# EAGLE design SatNOGSBoard (EAGLE 7.2.0)
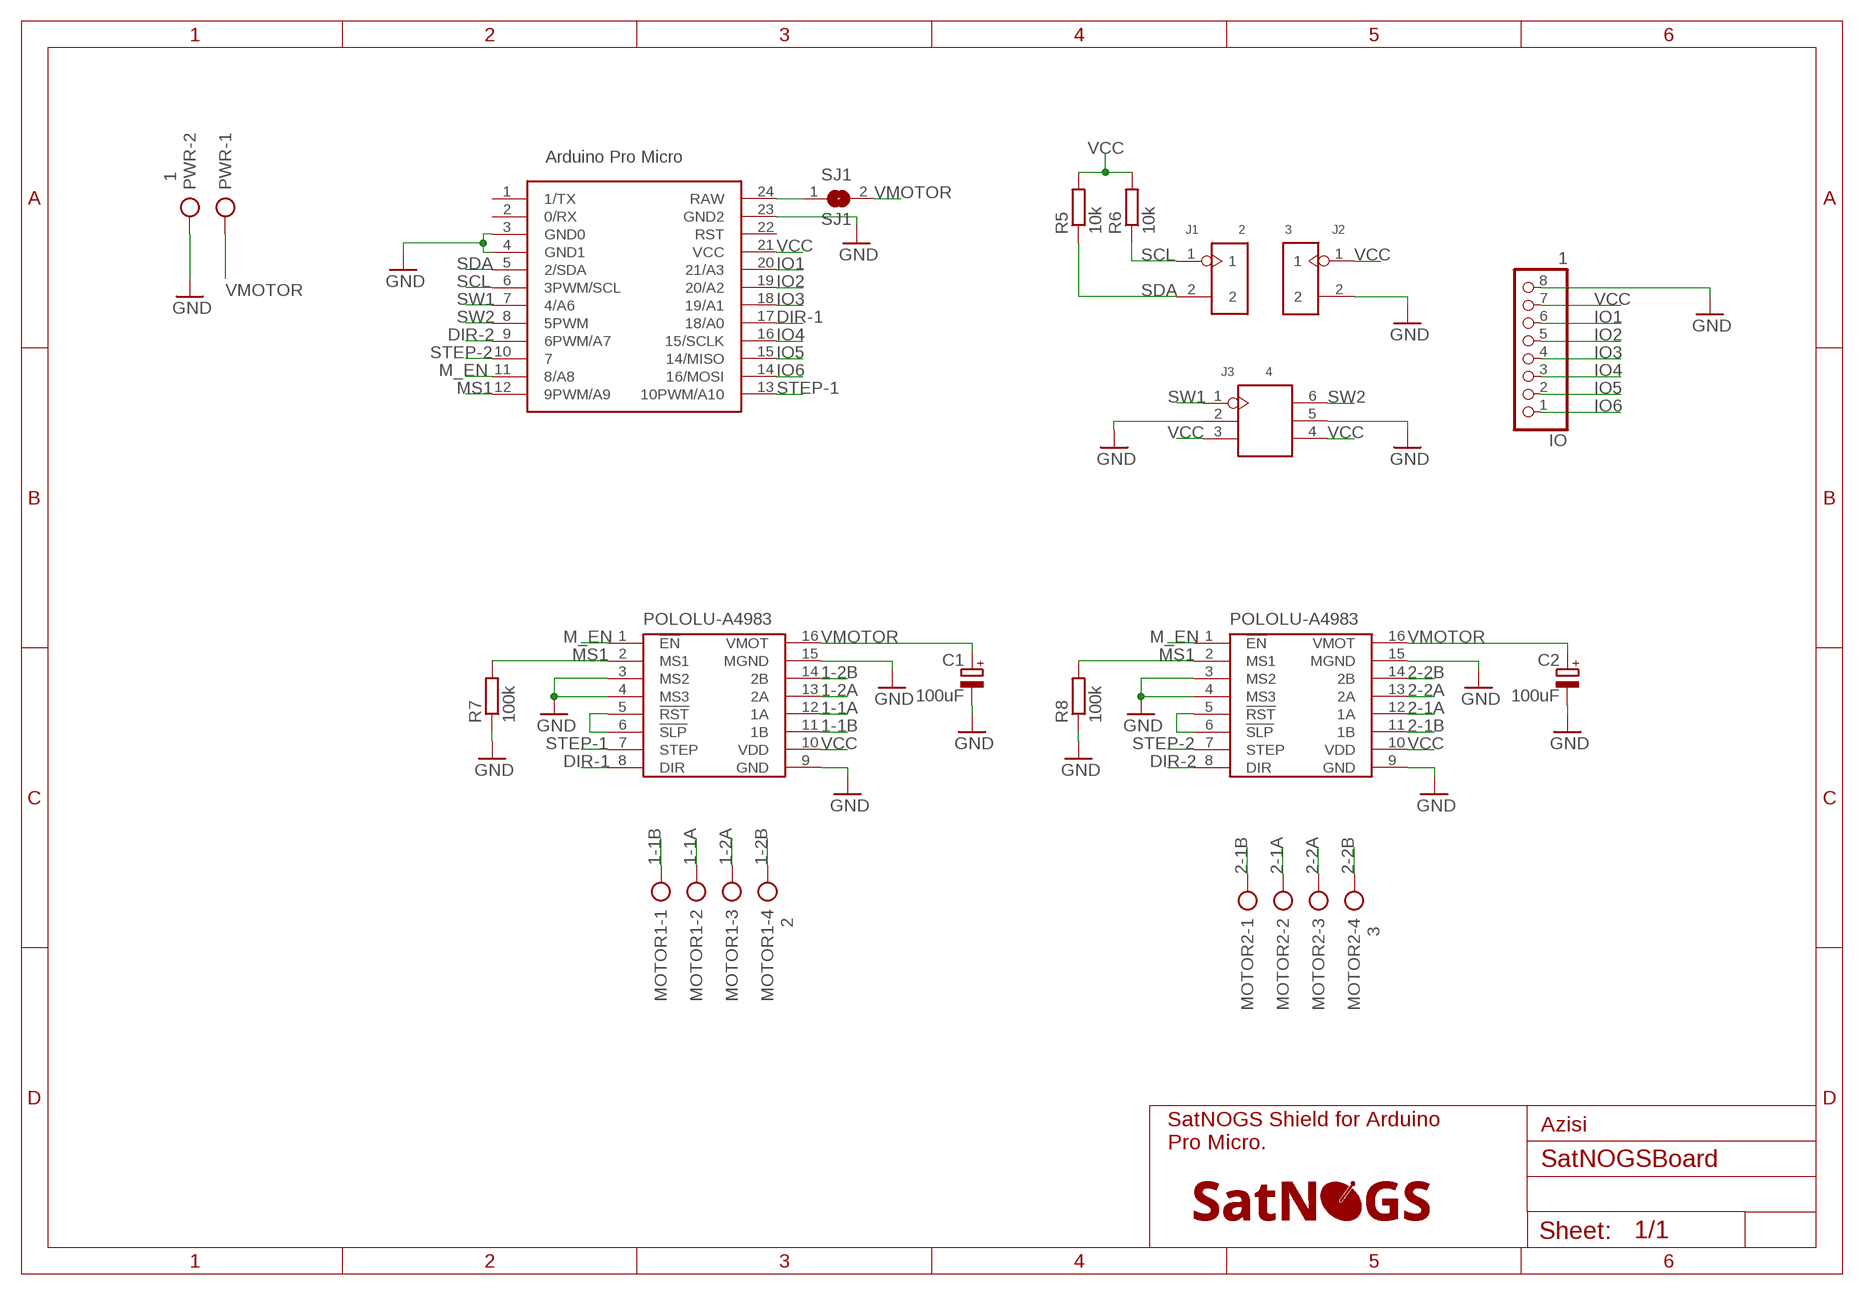
[diagram p0: schematic, sheet 1]

## Parts
AZIMUTH  POLOLU-A4983POLOLU-A4983  [POLOLU-A4983]
C1  100uF  CPOL-EUE2.5-6  [E2,5-6]
C2  100uF  CPOL-EUE2.5-6  [E2,5-6]
ELEVATION  POLOLU-A4983POLOLU-A4983  [POLOLU-A4983]
IO  1  PINHD-1X8  [1X08]
J1  2  HEADER-2P-65/35MIL  [2P-2.54-65/35MIL]
J2  3  HEADER-2P-65/35MIL  [2P-2.54-65/35MIL]
J3  4  HEADER-2X3P-2.54  [2X3P-2.54-65/35MIL]
MOTOR1  2  AK500/4  [AK500/4]
MOTOR2  3  AK500/4  [AK500/4]
PWR  1  AK500/2  [AK500/2]
R5  10k  R-EU_R0805  [R0805]
R6  10k  R-EU_R0805  [R0805]
R7  100k  R-EU_R0805  [R0805]
R8  100k  R-EU_R0805  [R0805]
SJ1  SJ1  SJW  [SJW]
U$1  SATNOGS_LOGORESTRICT_M  [LOGO_RESTRICT_M]
UC  ARDUINO_PRO_MICROARDUINO_BOARD  [ARDUINO_MICRO_PRO]

## Nets
1-1A: AZIMUTH.12(1A) MOTOR1.2
1-1B: AZIMUTH.11(1B) MOTOR1.1
1-2A: AZIMUTH.13(2A) MOTOR1.3
1-2B: AZIMUTH.14(2B) MOTOR1.4
2-1A: ELEVATION.12(1A) MOTOR2.2
2-1B: ELEVATION.11(1B) MOTOR2.1
2-2A: ELEVATION.13(2A) MOTOR2.3
2-2B: ELEVATION.14(2B) MOTOR2.4
DIR-1: AZIMUTH.8(DIR) UC.17(18/A0)
DIR-2: ELEVATION.8(DIR) UC.9(6PWM/A7)
GND: AZIMUTH.3(MS2) AZIMUTH.4(MS3) AZIMUTH.9(GND) AZIMUTH.15(MGND) C1.- C2.- ELEVATION.3(MS2) ELEVATION.4(MS3) ELEVATION.9(GND) ELEVATION.15(MGND) IO.8 J2.2 J3.2 J3.5 PWR.2 R7.1 R8.1 UC.3(GND0) UC.4(GND1) UC.23(GND2)
IO1: IO.6 UC.20(21/A3)
IO2: IO.5 UC.19(20/A2)
IO3: IO.4 UC.18(19/A1)
IO4: IO.3 UC.16(15/SCLK)
IO5: IO.2 UC.15(14/MISO)
IO6: IO.1 UC.14(16/MOSI)
M_EN: AZIMUTH.1(!EN) ELEVATION.1(!EN) UC.11(8/A8)
MS1: AZIMUTH.2(MS1) ELEVATION.2(MS1) R7.2 R8.2 UC.12(9PWM/A9)
N$1: AZIMUTH.5(!RST) AZIMUTH.6(!SLP)
N$2: ELEVATION.5(!RST) ELEVATION.6(!SLP)
N$3: SJ1.1 UC.24(RAW)
SCL: J1.1 R6.1 UC.6(3PWM/SCL)
SDA: J1.2 R5.1 UC.5(2/SDA)
STEP-1: AZIMUTH.7(STEP) UC.13(10PWM/A10)
STEP-2: ELEVATION.7(STEP) UC.10
SW1: J3.1 UC.7(4/A6)
SW2: J3.6 UC.8(5PWM)
VCC: AZIMUTH.10(VDD) ELEVATION.10(VDD) IO.7 J2.1 J3.3 J3.4 R5.2 R6.2 UC.21(VCC)
VMOTOR: AZIMUTH.16(VMOT) C1.+ C2.+ ELEVATION.16(VMOT) PWR.1 SJ1.2
Unconnected: UC.1(1/TX) UC.2(0/RX) UC.22(RST)

## Notes on the sheet
- Azisi
- SatNOGS Shield for Arduino
  Pro Micro.

## Library data of the parts
AZIMUTH ELEVATION = satnogs:POLOLU-A4983
C1 C2 = rcl:CPOL-EU: POLARIZED CAPACITOR, European symbol
IO = pinhead:PINHD-1X8: PIN HEADER
J1 J2 = Connector:HEADER-2P
J3 = Connector:HEADER-2X3P
MOTOR1 MOTOR2 = con-ptr500:AK500/4: CONNECTOR; OC_FARNELL: unknown; OC_NEWARK: unknown
PWR = con-ptr500:AK500/2: CONNECTOR; OC_FARNELL: unknown; OC_NEWARK: unknown
R5-R8 = rcl:R-EU_: RESISTOR, European symbol
SJ1 = jumper:SJ: SMD solder JUMPER
U$1 = satnogs:SATNOGS_LOGO
UC = Arduino_Pro_Micro:ARDUINO_PRO_MICRO

## Board
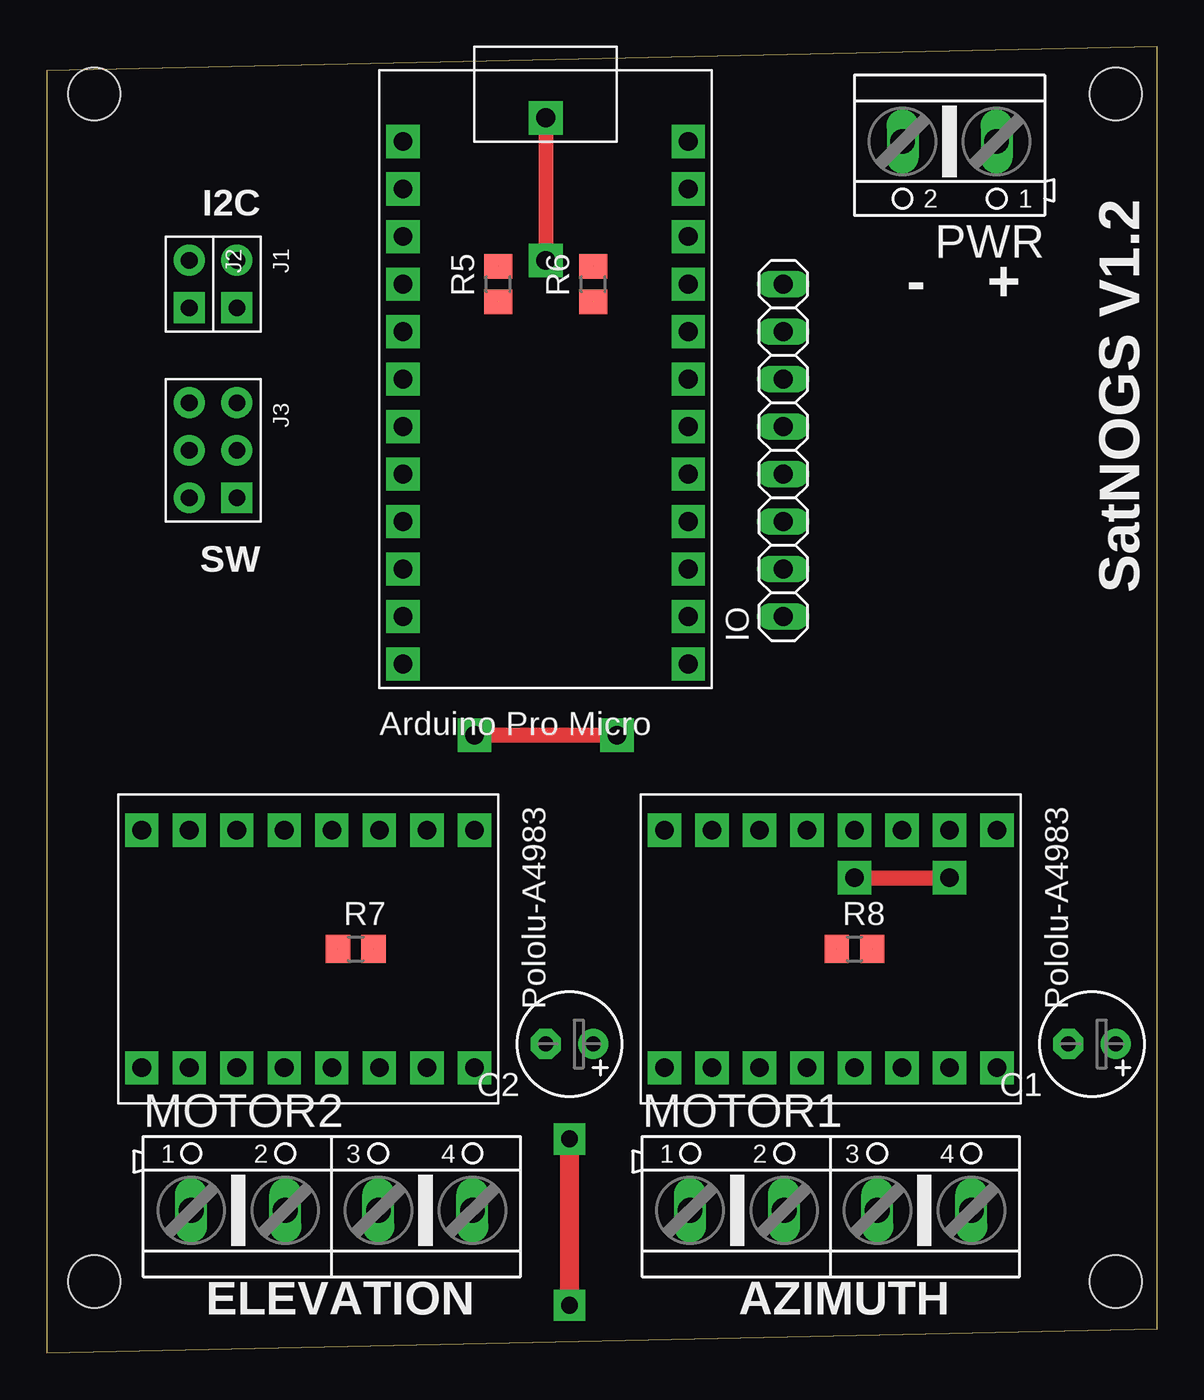
[diagram p1: board, top side]
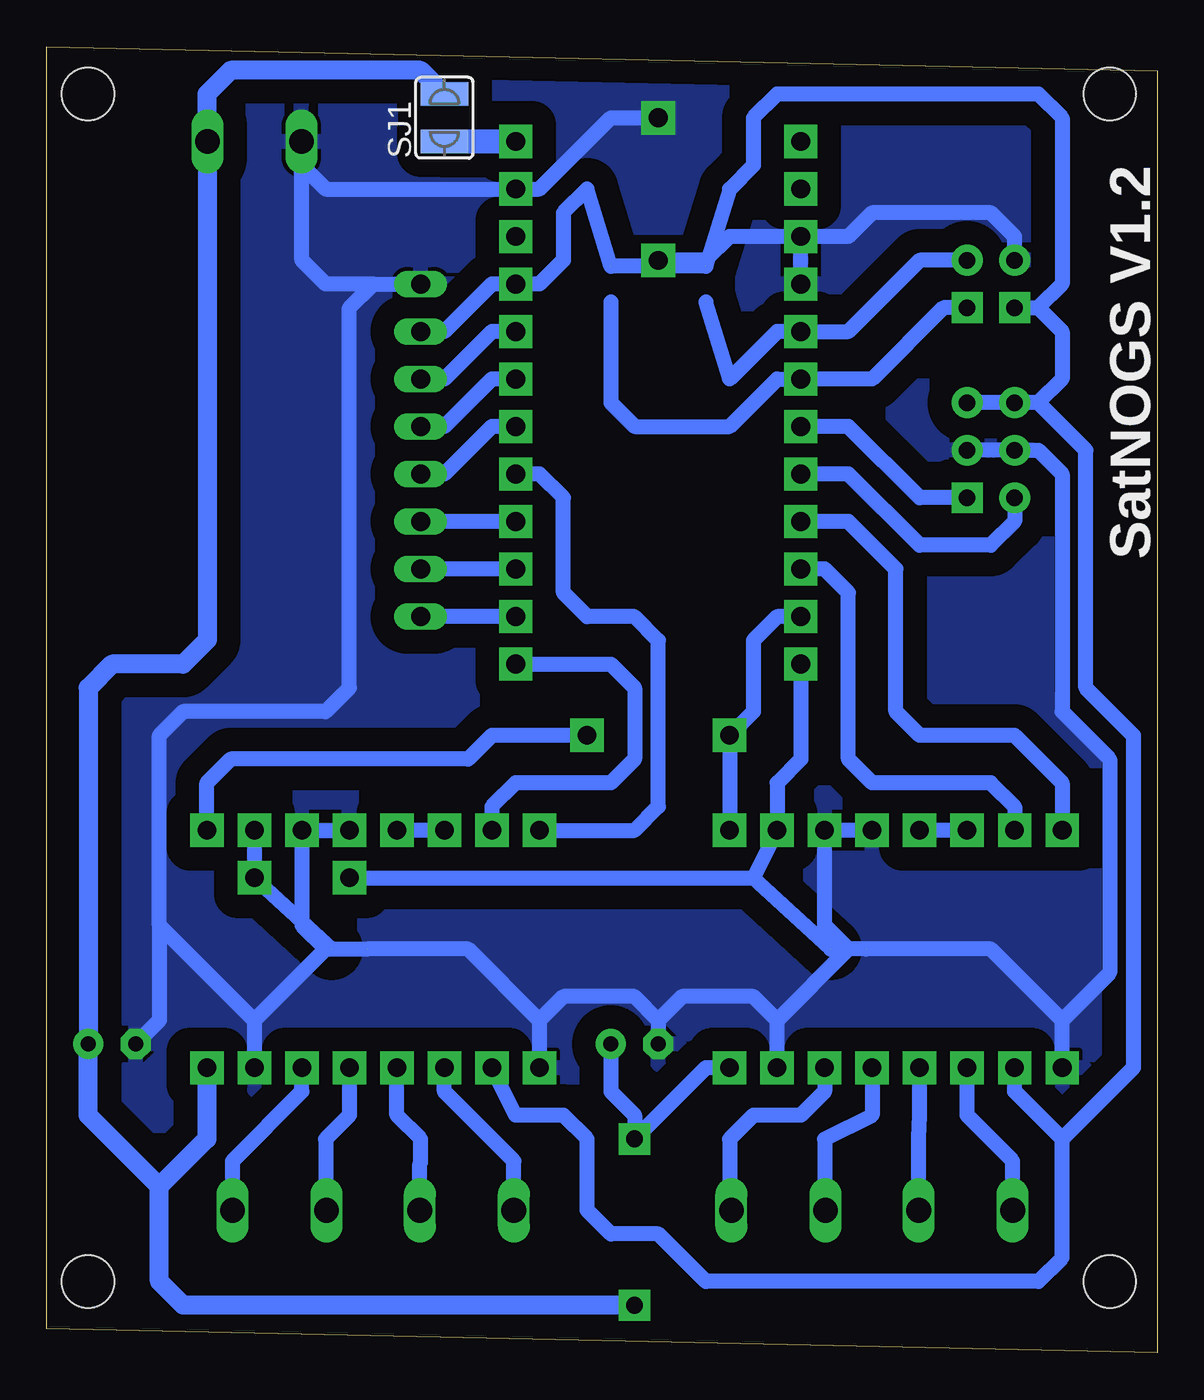
[diagram p2: board, bottom side, seen from below]

Size 59.36 x 69.84 mm. Coordinates in mm from the lower left corner, seen from the top.
Outline: 0,0 59.36,1.27 59.36,69.84 0,68.57 0,0
Copper layers (1*16): Top 0.035mm / dielectric 1.5mm / Bottom 0.035mm
Design rules "PCB-POOL Standard": minimum track width 0.15mm, minimum drill 0.3mm, track to track 0.15mm, track to pad 0.15mm, pad to pad 0.15mm, via to via 0.15mm, smd to smd 0.15mm, copper to edge 0.3mm, drill to drill 0.2mm, minimum pad ring 0.2mm, minimum via ring 0.15mm, stop-mask expansion 0.075mm, vias tented up to drill 0mil, thermal gap 0.2mm
Holes 2.8 mm at 2.54,67.31 57.15,67.31 2.54,3.81 57.15,3.81

### Footprints (pad centres in the part's own frame; a part is rotated, then mirrored left to right if it is on the bottom)
POLOLU-A4983 = drill 1 pad 1.778 square: 1 -6.35,8.89; 2 -6.35,6.35; 3 -6.35,3.81; 4 -6.35,1.27; 5 -6.35,-1.27; 6 -6.35,-3.81; 7 -6.35,-6.35; 8 -6.35,-8.89; 9 6.35,-8.89; 10 6.35,-6.35; 11 6.35,-3.81; 12 6.35,-1.27; 13 6.35,1.27; 14 6.35,3.81; 15 6.35,6.35; 16 6.35,8.89
E2,5-6 = drill 0.813 pad 1.6: + -1.27,0 | drill 0.813 pad 1.6 octagon: - 1.27,0
1X08 = drill 1.016 long: 1 -8.89,0; 2 -6.35,0; 3 -3.81,0; 4 -1.27,0; 5 1.27,0; 6 3.81,0; 7 6.35,0; 8 8.89,0
2P-2.54-65/35MIL = drill 0.889 pad 1.651 square: 1 0,1.27 | drill 0.889 pad 1.651: 2 0,-1.27
2X3P-2.54-65/35MIL = drill 0.889 pad 1.651 square: 1 -1.27,2.54 | drill 0.889 pad 1.651: 2 -1.27,0; 3 -1.27,-2.54; 4 1.27,-2.54; 5 1.27,0; 6 1.27,2.54
AK500/4 = drill 1.321 long: 1 -7.518,0; 2 -2.489,0; 3 2.489,0; 4 7.518,0
AK500/2 = drill 1.321 long: 1 -2.515,0; 2 2.515,0
R0805 = smd 1.3 x 1.5: 1 -0.95,0; 2 0.95,0
SJW = smd 1.27 x 2.54: 1 -1.27,0; 2 1.27,0
ARDUINO_MICRO_PRO = drill 1 pad 1.778 square: 1 -7.62,12.7; 2 -7.62,10.16; 3 -7.62,7.62; 4 -7.62,5.08; 5 -7.62,2.54; 6 -7.62,0; 7 -7.62,-2.54; 8 -7.62,-5.08; 9 -7.62,-7.62; 10 -7.62,-10.16; 11 -7.62,-12.7; 12 -7.62,-15.24; 13 7.62,-15.24; 14 7.62,-12.7; 15 7.62,-10.16; 16 7.62,-7.62; 17 7.62,-5.08; 18 7.62,-2.54; 19 7.62,0; 20 7.62,2.54; 21 7.62,5.08; 22 7.62,7.62; 23 7.62,10.16; 24 7.62,12.7

### Placement (x,y rotation side)
AZIMUTH  41.91,21.59 270 top
C1  55.88,16.51 180 top
C2  27.94,16.51 180 top
ELEVATION  13.97,21.59 270 top
IO  39.37,48.26 90 top
J1  10.16,57.15 180 top
J2  7.62,57.15 180 top
J3  8.89,48.26 180 top
MOTOR1  41.91,7.62 0 top
MOTOR2  15.24,7.62 0 top
PWR  48.26,64.77 180 top
R5  24.13,57.15 90 top
R6  29.21,57.15 90 top
R7  16.51,21.59 0 top
R8  43.18,21.59 0 top
SJ1  38.1,66.04 90 bottom
U$1  -8.89,24.13 90 top  (outside the outline)
UC  26.67,52.07 0 top

### Tracks (layer width: path | path; a pad name or v marks a point on that pad's centre or on a via)
1-1A
  Bottom 0.813: MOTOR1.2 39.42,10.11 39.37,10.16 39.37,11.43 40.64,12.7 AZIMUTH.12
1-1B
  Bottom 0.813: MOTOR1.1 34.39,10.26 38.1,13.97 AZIMUTH.11
1-2A
  Bottom 0.813: AZIMUTH.13 43.18,12.7 44.45,11.43 44.45,7.67 MOTOR1.3
1-2B
  Bottom 0.813: MOTOR1.4 49.43,10.26 45.72,13.97 AZIMUTH.14
2-1A
  Bottom 0.813: MOTOR2.2 12.75,11.48 12.7,12.7 ELEVATION.12
2-1B
  Bottom 0.813: MOTOR2.1 7.72,10.26 10.16,12.7 ELEVATION.11
2-2A
  Bottom 0.813: ELEVATION.13 15.24,12.7 17.78,11.43 17.78,7.67 MOTOR2.3
2-2B
  Bottom 0.813: MOTOR2.4 22.86,7.72 22.86,11.43 21.59,12.7 19.05,12.7 17.78,13.97 ELEVATION.14
DIR-1
  Bottom 0.813: AZIMUTH.8 27.94,27.94 26.67,29.21 26.67,38.1 27.94,39.37 30.48,39.37 31.75,40.64 31.75,45.72 33.02,46.99 UC.17
DIR-2
  Bottom 0.813: ELEVATION.8 5.08,30.48 7.62,33.02 12.7,33.02 13.97,34.29 13.97,41.91 16.51,44.45 UC.9
GND  (via drill 1 pad 1.78)  (2 unrouted)
  Top 0.813: v26.67,66.04 v26.67,58.42
  Bottom 0.813: UC.4 UC.3 | ELEVATION.4 ELEVATION.3 17.78,22.86 16.51,21.59 | AZIMUTH.4 AZIMUTH.3 45.72,22.86 44.45,21.59 | ELEVATION.9 5.08,17.78 | 16.51,21.59 R7.1 8.89,21.59 5.08,17.78 | ELEVATION.15 20.32,17.78 | 33.02,17.78 31.75,19.05 27.94,19.05 26.67,17.78 | 33.02,17.78 AZIMUTH.9 | 48.26,17.78 AZIMUTH.15 | 44.45,21.59 R8.1 36.83,21.59 33.02,17.78 | 44.45,21.59 48.26,17.78 | 48.26,17.78 53.34,22.86 | 53.34,22.86 53.34,33.02 52.07,34.29 44.45,34.29 43.18,35.56 43.18,55.88 41.91,57.15 | UC.3 22.86,59.69 24.13,58.42 v26.67,58.42 | 20.32,17.78 16.51,21.59 | v26.67,66.04 29.21,66.04 33.02,62.23 UC.23 44.45,62.23 45.72,63.5 | 5.08,17.78 2.54,20.32 2.54,31.75 5.08,34.29 5.08,46.99 6.35,48.26 J3.5 J3.2 | UC.3 16.51,59.69 15.24,60.96 8.89,60.96 7.62,59.69 J2.2 | 53.34,22.86 53.34,17.78 C1.- | 26.67,17.78 25.4,19.05 21.59,19.05 20.32,17.78 | 26.67,17.78 C2.- | 41.91,57.15 IO.8 | 41.91,57.15 44.45,57.15 45.72,58.42 45.72,63.5 | 45.72,63.5 45.72,64.75 PWR.2
  pour Bottom (isolate 1.27): 0,69.85 0,1.27 59.69,1.27 59.69,69.85
IO1
  Bottom 0.813: UC.20 35.56,54.61 38.1,52.07 IO.6
IO2
  Bottom 0.813: UC.19 35.56,52.07 38.1,49.53 IO.5
IO3
  Bottom 0.813: UC.18 35.56,49.53 38.1,46.99 IO.4
IO4
  Bottom 0.813: UC.16 IO.3
IO5
  Bottom 0.813: UC.15 IO.2
IO6
  Bottom 0.813: UC.14 IO.1
M_EN  (via drill 1 pad 1.78)
  Top 0.813: v30.48,33.02 v22.86,33.02
  Bottom 0.813: ELEVATION.1 v22.86,33.02 21.59,34.29 21.59,38.1 20.32,39.37 UC.11 | AZIMUTH.1 50.8,30.48 49.53,31.75 36.83,31.75 35.56,33.02 v30.48,33.02
MS1  (via drill 1 pad 1.78)  (2 unrouted)
  Top 0.813: v43.18,25.4 v48.26,25.4
  Bottom 0.813: UC.12 19.05,31.75 20.32,30.48 ELEVATION.2 21.59,25.4 | R8.2 v48.26,25.4 AZIMUTH.2 | R7.2 21.59,25.4 | v43.18,25.4 21.59,25.4
N$1
  Bottom 0.813: AZIMUTH.6 AZIMUTH.5
N$2
  Bottom 0.813: ELEVATION.6 ELEVATION.5
N$3
  Bottom 1.27: UC.24 SJ1.1
N$4
  pour Top: -17.78,60.96 -3.81,60.96 -3.81,20.32 -17.78,20.32
SCL  (1 unrouted)
  Bottom 0.813: R6.1 29.21,50.8 27.94,49.53 22.86,49.53 20.32,52.07 UC.6 15.24,52.07 11.43,55.88 J1.1
SDA  (1 unrouted)
  Bottom 0.813: R5.1 22.86,52.07 20.32,54.61 UC.5 16.51,54.61 12.7,58.42 J1.2
STEP-1
  Bottom 0.813: AZIMUTH.7 35.56,29.21 34.29,30.48 29.21,30.48 27.94,31.75 27.94,35.56 29.21,36.83 UC.13
STEP-2
  Bottom 0.813: UC.10 17.78,41.91 16.51,40.64 16.51,31.75 15.24,30.48 8.89,30.48 7.62,29.21 ELEVATION.7
SW1
  Bottom 0.813: J3.1 12.7,45.72 16.51,49.53 UC.7
SW2
  Bottom 0.813: J3.6 7.62,44.45 8.89,43.18 12.7,43.18 16.51,46.99 UC.8
VCC  (2 unrouted)
  Bottom 0.813: AZIMUTH.10 34.29,12.7 31.75,12.7 30.48,11.43 30.48,7.62 29.21,6.35 26.67,6.35 24.13,3.81 6.35,3.81 5.08,5.08 5.08,11.43 | IO.7 38.1,54.61 35.56,57.15 UC.21 33.02,57.15 31.75,58.42 31.75,60.96 30.48,62.23 R6.2 R5.2 22.86,62.23 21.59,63.5 21.59,66.04 20.32,67.31 6.35,67.31 5.08,66.04 5.08,57.15 6.35,55.88 | 5.08,11.43 1.27,15.24 1.27,33.02 3.81,35.56 3.81,48.26 6.35,50.8 | 5.08,11.43 7.62,13.97 ELEVATION.10 | J2.1 6.35,55.88 | 6.35,55.88 5.08,54.61 5.08,52.07 6.35,50.8 | 6.35,50.8 J3.4 J3.3
VMOTOR  (via drill 0.9 pad 1.68)
  Top 1.016: v27.94,11.43 v27.94,2.54
  Bottom 0.813: C2.+ 29.21,13.97 27.94,12.7 v27.94,11.43 24.13,15.24 ELEVATION.16
  Bottom 1.016: v27.94,2.54 52.07,2.54 53.34,3.81 53.34,8.89 | 53.34,8.89 57.15,12.7 C1.+ 57.15,35.56 55.88,36.83 52.07,36.83 50.77,38.12 PWR.1 50.8,64.8 50.8,67.31 49.53,68.58 39.37,68.58 SJ1.2 | AZIMUTH.16 50.8,11.43 53.34,8.89

### Text on the board
tPlace: I2C | - | + | SW | SatNOGS V1.2 | ELEVATION | AZIMUTH
bPlace: SatNOGS V1.2